# Altium schematic sheet Модуль MCU.SchDoc
size 420 x 297 mm; DocumentNumber: 8; SheetNumber: 8; SheetTotal: 11; ListNumber: 1
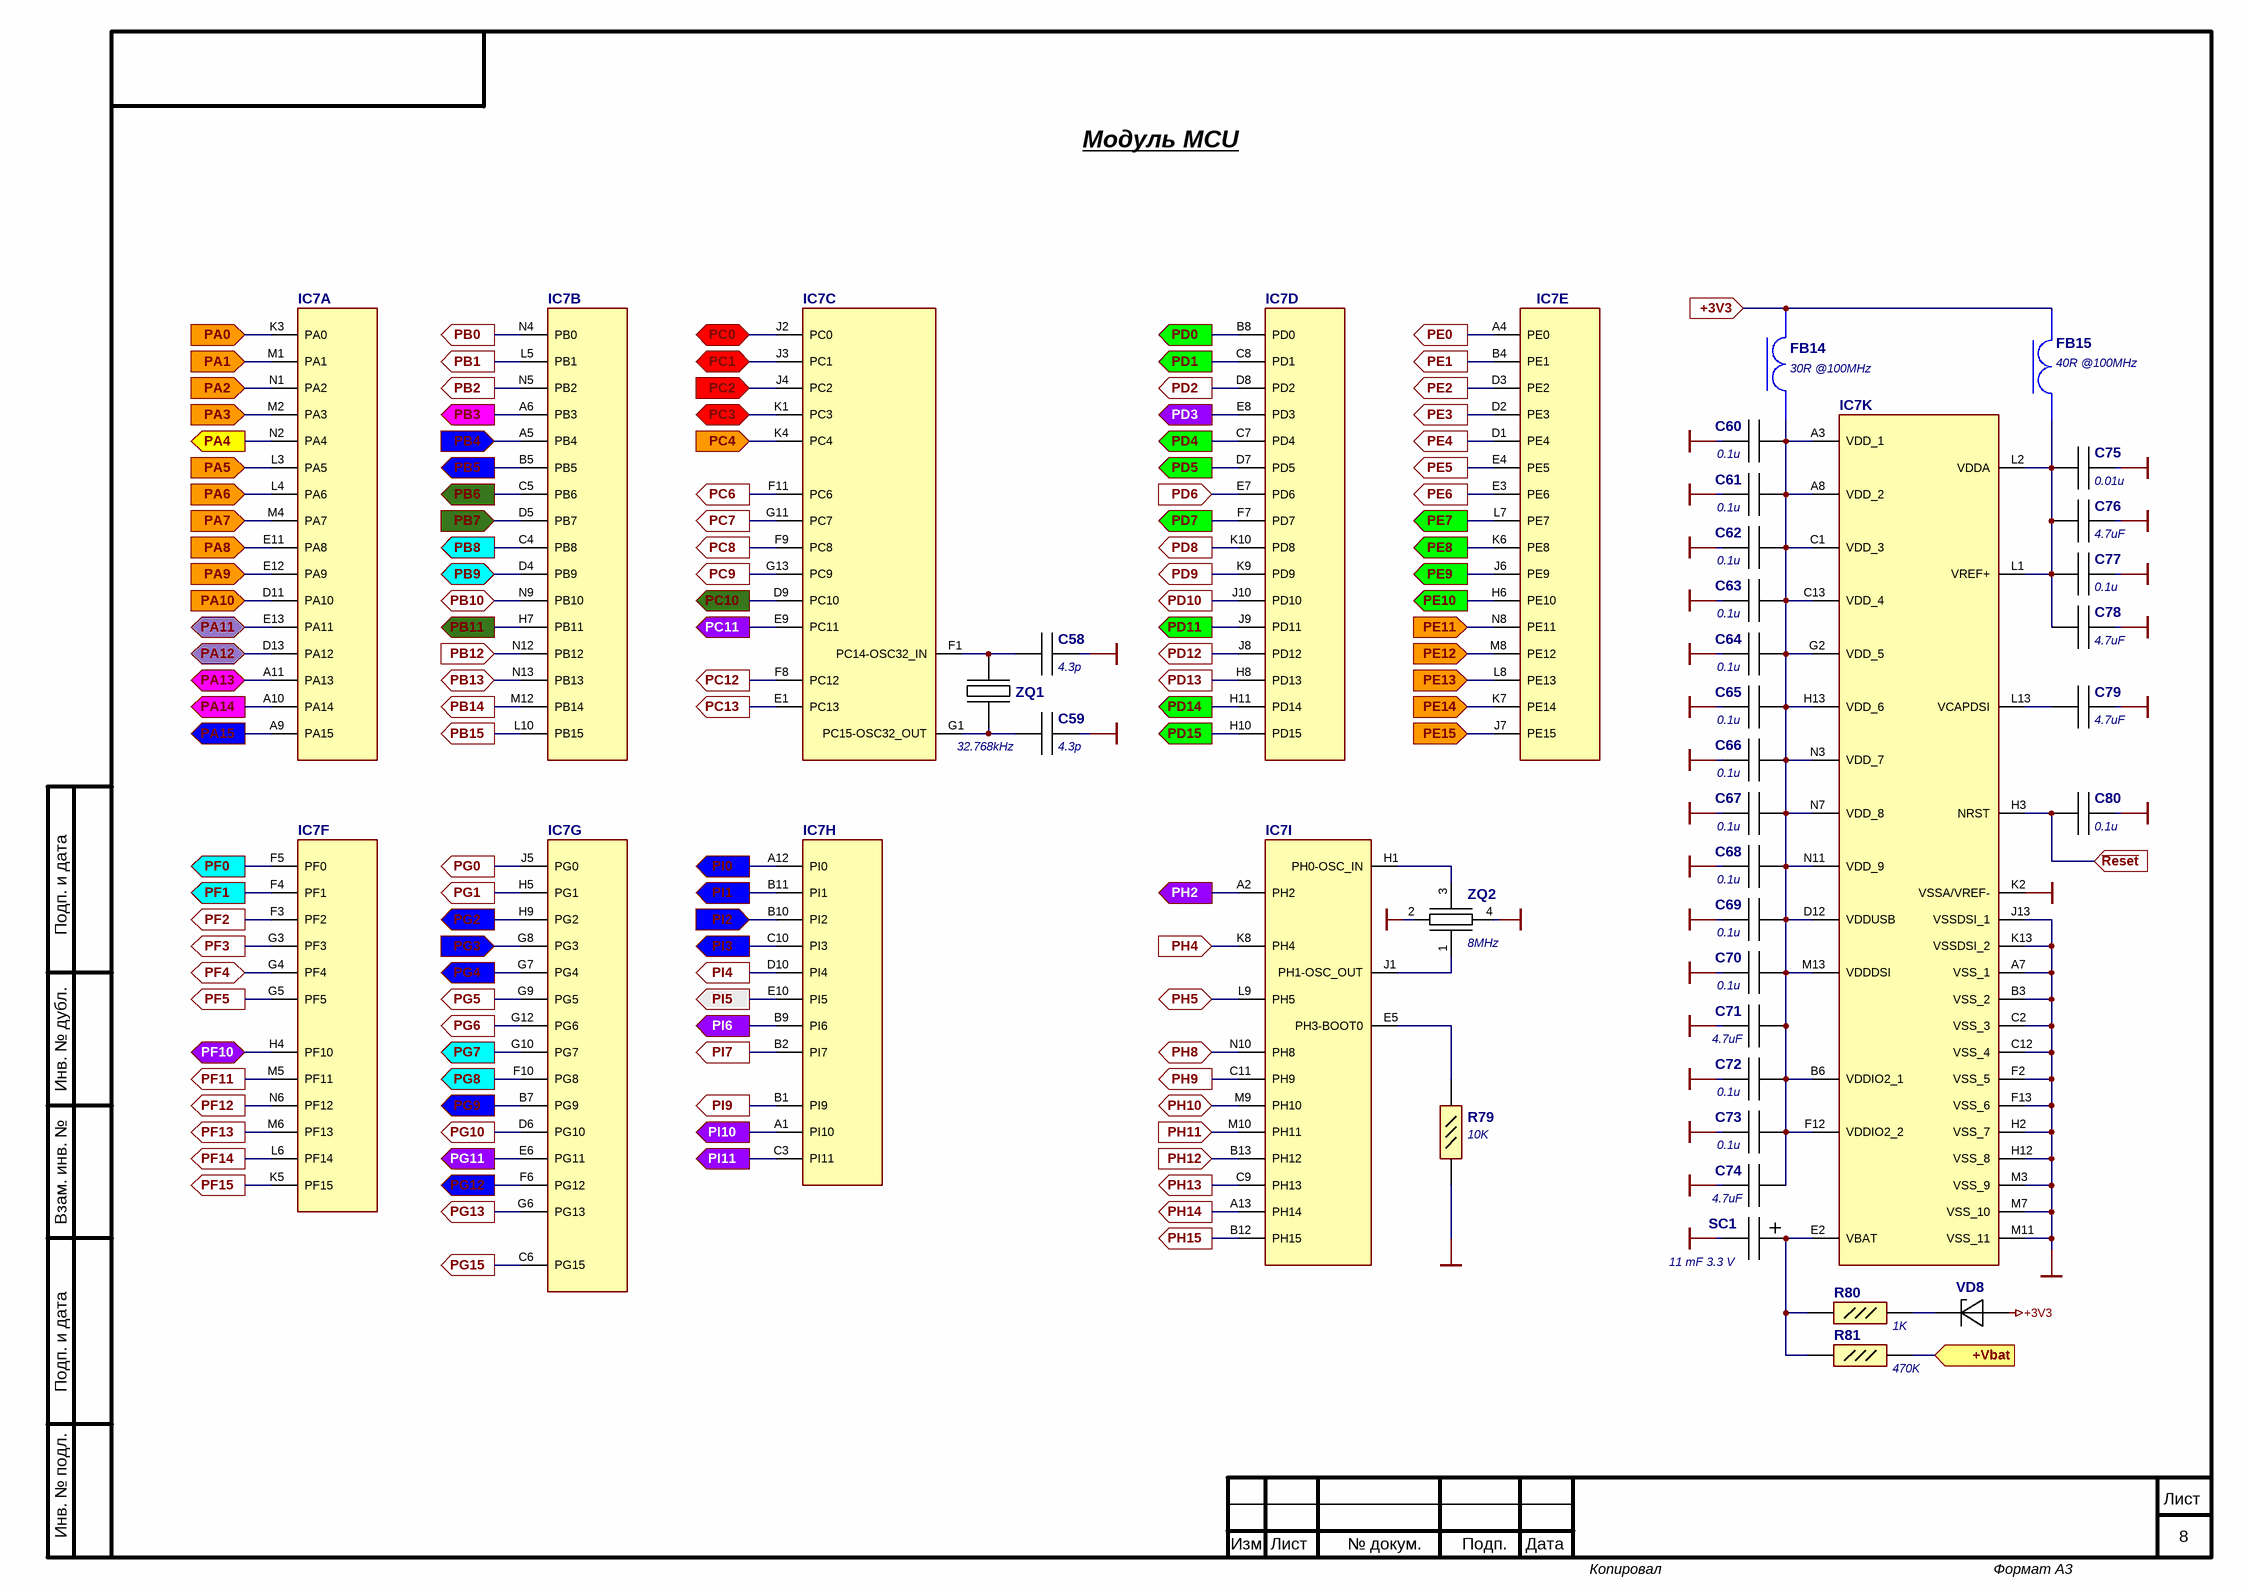
[diagram p0: Модуль MCU.SchDoc]

## Parts
C58  4.3p  [:CAP0402 100x50x50]
C59  4.3p  [:CAP0402 100x50x50]
C60  0.1u  [:CAP0402 100x50x50]
C61  0.1u  [:CAP0402 100x50x50]
C62  0.1u  [:CAP0402 100x50x50]
C63  0.1u  [:CAP0402 100x50x50]
C64  0.1u  [:CAP0402 100x50x50]
C65  0.1u  [:CAP0402 100x50x50]
C66  0.1u  [:CAP0402 100x50x50]
C67  0.1u  [:CAP0402 100x50x50]
C68  0.1u  [:CAP0402 100x50x50]
C69  0.1u  [:CAP0402 100x50x50]
C70  0.1u  [:CAP0402 100x50x50]
C71  4.7uF  [:CAP0805 C2012X125]
C72  0.1u  [:CAP0402 100x50x50]
C73  0.1u  [:CAP0402 100x50x50]
C74  4.7uF  [:CAP0805 C2012X125]
C75  0.01u  [:CAP0402 100x50x50]
C76  4.7uF  [:CAP0805 C2012X125]
C77  0.1u  [:CAP0402 100x50x50]
C78  4.7uF  [:CAP0805 C2012X125]
C79  4.7uF  [:CAP0805 C2012X125]
C80  0.1u  [:CAP0402 100x50x50]
FB14  30R @100MHz  [:FER BLM18SP300SN1D]
FB15  40R @100MHz  [:FER MMZ1005Y400CTD25]
IC7  STM32L4S9AII6  [:BGA169 P700X700X60]  (value not drawn)  (parts A,B,C,D,E,F,G,H,I,K of 11)
R79  Manufacturer_Part_Number (part 2: value): 10K  [:RES0402]  (hidden comment: RC0402FR-07)
R80  Manufacturer_Part_Number (part 2: value): 1K  [:RES0402]  (hidden comment: RC0402FR-07)
R81  Manufacturer_Part_Number (part 2: value): 470K  [:RES0402]  (hidden comment: RC0402FR-07)
SC1  11 mF 3.3 V  [:CAP CPH3225A]
VD8  30V 0.1A  [:DIODE SOD-923F]  (value not drawn)
ZQ1  32.768kHz  [:RESO 12.87181]
ZQ2  8MHz  [:RESO LFXTAL069277REEL]

## Ports
+3V3 (in), +Vbat (in), PA0 (in), PA1 (in), PA2 (in), PA3 (in), PA4 (out), PA5 (in), PA6 (in), PA7 (in), PA8 (in), PA9 (in), PA10 (in), PA11 (bidir), PA12 (bidir), PA13 (bidir), PA14 (out), PA15 (out), PB0 (out), PB1 (out), PB2 (out), PB3 (out), PB4 (in), PB5 (out), PB6 (out), PB7 (in), PB8 (out), PB9 (bidir), PB10 (bidir), PB11 (out), PB12 (in), PB13 (bidir), PB14 (out), PB15 (out), PC0 (bidir), PC1 (bidir), PC2 (in), PC3 (bidir), PC4 (in), PC6 (out), PC7 (out), PC8 (out), PC9 (out), PC10 (out), PC11 (out), PC12 (out), PC13 (out), PD0 (out), PD1 (out), PD2 (out), PD3 (out), PD4 (out), PD5 (out), PD6 (in), PD7 (out), PD8 (out), PD9 (out), PD10 (out), PD11 (out), PD12 (out), PD13 (out), PD14 (out), PD15 (out), PE0 (out), PE1 (out), PE2 (out), PE3 (out), PE4 (out), PE5 (out), PE6 (out), PE7 (out), PE8 (out), PE9 (out), PE10 (out), PE11 (in), PE12 (in), PE13 (in), PE14 (in), PE15 (in), PF0 (out), PF1 (out), PF2 (out), PF3 (out), PF4 (bidir), PF5 (out), PF10 (bidir), PF11 (out), PF12 (out), PF13 (out), PF14 (out), PF15 (out), PG0 (out), PG1 (out), PG2 (out), PG3 (in), PG4 (out), PG5 (out), PG6 (out), PG7 (out), PG8 (out), PG9 (out), PG10 (out), PG11 (out), PG12 (out), PG13 (out), PG15 (out), PH2 (out), PH4 (in), PH5 (bidir), PH8 (bidir), PH9 (out), PH10 (bidir), PH11 (in), PH12 (in), PH13 (out), PH14 (out), PH15 (out), PI0 (out), PI1 (out), PI2 (in), PI3 (out), PI4 (out), PI5 (out), PI6 (out), PI7 (out), PI9 (out), PI10 (out), PI11 (out), ~{Reset} (in)

## Nets
+3V3: VD8.2(A)
GND: C58.2 C59.2 C60.1 C61.1 C62.1 C63.1 C64.1 C65.1 C66.1 C67.1 C68.1 C69.1 C70.1 C71.2 C72.1 C73.1 C74.2 C75.2 C76.2 C77.2 C78.2 C79.2 C80.2 IC7.A7(VSS_1) IC7.B3(VSS_2) IC7.C2(VSS_3) IC7.C12(VSS_4) IC7.F2(VSS_5) IC7.F13(VSS_6) IC7.H2(VSS_7) IC7.H12(VSS_8) IC7.J13(VSSDSI_1) IC7.K2(VSSA/VREF-) IC7.K13(VSSDSI_2) IC7.M3(VSS_9) IC7.M7(VSS_10) IC7.M11(VSS_11) R79.1 SC1.2(-) ZQ2.2 ZQ2.4
+3V3: FB14.2 FB15.1 ; port +3V3  [a separate net that carries the same name]
+Vbat: R81.1 ; port +Vbat
PA0: IC7.K3(PA0) ; port PA0
PA1: IC7.M1(PA1) ; port PA1
PA2: IC7.N1(PA2) ; port PA2
PA3: IC7.M2(PA3) ; port PA3
PA4: IC7.N2(PA4) ; port PA4
PA5: IC7.L3(PA5) ; port PA5
PA6: IC7.L4(PA6) ; port PA6
PA7: IC7.M4(PA7) ; port PA7
PA8: IC7.E11(PA8) ; port PA8
PA9: IC7.E12(PA9) ; port PA9
PA10: IC7.D11(PA10) ; port PA10
PA11: IC7.E13(PA11) ; port PA11
PA12: IC7.D13(PA12) ; port PA12
PA13: IC7.A11(PA13) ; port PA13
PA14: IC7.A10(PA14) ; port PA14
PA15: IC7.A9(PA15) ; port PA15
PB0: IC7.N4(PB0) ; port PB0
PB1: IC7.L5(PB1) ; port PB1
PB2: IC7.N5(PB2) ; port PB2
PB3: IC7.A6(PB3) ; port PB3
PB4: IC7.A5(PB4) ; port PB4
PB5: IC7.B5(PB5) ; port PB5
PB6: IC7.C5(PB6) ; port PB6
PB7: IC7.D5(PB7) ; port PB7
PB8: IC7.C4(PB8) ; port PB8
PB9: IC7.D4(PB9) ; port PB9
PB10: IC7.N9(PB10) ; port PB10
PB11: IC7.H7(PB11) ; port PB11
PB12: IC7.N12(PB12) ; port PB12
PB13: IC7.N13(PB13) ; port PB13
PB14: IC7.M12(PB14) ; port PB14
PB15: IC7.L10(PB15) ; port PB15
PC0: IC7.J2(PC0) ; port PC0
PC1: IC7.J3(PC1) ; port PC1
PC2: IC7.J4(PC2) ; port PC2
PC3: IC7.K1(PC3) ; port PC3
PC4: IC7.K4(PC4) ; port PC4
PC6: IC7.F11(PC6) ; port PC6
PC7: IC7.G11(PC7) ; port PC7
PC8: IC7.F9(PC8) ; port PC8
PC9: IC7.G13(PC9) ; port PC9
PC10: IC7.D9(PC10) ; port PC10
PC11: IC7.E9(PC11) ; port PC11
PC12: IC7.F8(PC12) ; port PC12
PC13: IC7.E1(PC13) ; port PC13
PD0: IC7.B8(PD0) ; port PD0
PD1: IC7.C8(PD1) ; port PD1
PD2: IC7.D8(PD2) ; port PD2
PD3: IC7.E8(PD3) ; port PD3
PD4: IC7.C7(PD4) ; port PD4
PD5: IC7.D7(PD5) ; port PD5
PD6: IC7.E7(PD6) ; port PD6
PD7: IC7.F7(PD7) ; port PD7
PD8: IC7.K10(PD8) ; port PD8
PD9: IC7.K9(PD9) ; port PD9
PD10: IC7.J10(PD10) ; port PD10
PD11: IC7.J9(PD11) ; port PD11
PD12: IC7.J8(PD12) ; port PD12
PD13: IC7.H8(PD13) ; port PD13
PD14: IC7.H11(PD14) ; port PD14
PD15: IC7.H10(PD15) ; port PD15
PE0: IC7.A4(PE0) ; port PE0
PE1: IC7.B4(PE1) ; port PE1
PE2: IC7.D3(PE2) ; port PE2
PE3: IC7.D2(PE3) ; port PE3
PE4: IC7.D1(PE4) ; port PE4
PE5: IC7.E4(PE5) ; port PE5
PE6: IC7.E3(PE6) ; port PE6
PE7: IC7.L7(PE7) ; port PE7
PE8: IC7.K6(PE8) ; port PE8
PE9: IC7.J6(PE9) ; port PE9
PE10: IC7.H6(PE10) ; port PE10
PE11: IC7.N8(PE11) ; port PE11
PE12: IC7.M8(PE12) ; port PE12
PE13: IC7.L8(PE13) ; port PE13
PE14: IC7.K7(PE14) ; port PE14
PE15: IC7.J7(PE15) ; port PE15
PF0: IC7.F5(PF0) ; port PF0
PF1: IC7.F4(PF1) ; port PF1
PF2: IC7.F3(PF2) ; port PF2
PF3: IC7.G3(PF3) ; port PF3
PF4: IC7.G4(PF4) ; port PF4
PF5: IC7.G5(PF5) ; port PF5
PF10: IC7.H4(PF10) ; port PF10
PF11: IC7.M5(PF11) ; port PF11
PF12: IC7.N6(PF12) ; port PF12
PF13: IC7.M6(PF13) ; port PF13
PF14: IC7.L6(PF14) ; port PF14
PF15: IC7.K5(PF15) ; port PF15
PG0: IC7.J5(PG0) ; port PG0
PG1: IC7.H5(PG1) ; port PG1
PG2: IC7.H9(PG2) ; port PG2
PG3: IC7.G8(PG3) ; port PG3
PG4: IC7.G7(PG4) ; port PG4
PG5: IC7.G9(PG5) ; port PG5
PG6: IC7.G12(PG6) ; port PG6
PG7: IC7.G10(PG7) ; port PG7
PG8: IC7.F10(PG8) ; port PG8
PG9: IC7.B7(PG9) ; port PG9
PG10: IC7.D6(PG10) ; port PG10
PG11: IC7.E6(PG11) ; port PG11
PG12: IC7.F6(PG12) ; port PG12
PG13: IC7.G6(PG13) ; port PG13
PG15: IC7.C6(PG15) ; port PG15
PH2: IC7.A2(PH2) ; port PH2
PH4: IC7.K8(PH4) ; port PH4
PH5: IC7.L9(PH5) ; port PH5
PH8: IC7.N10(PH8) ; port PH8
PH9: IC7.C11(PH9) ; port PH9
PH10: IC7.M9(PH10) ; port PH10
PH11: IC7.M10(PH11) ; port PH11
PH12: IC7.B13(PH12) ; port PH12
PH13: IC7.C9(PH13) ; port PH13
PH14: IC7.A13(PH14) ; port PH14
PH15: IC7.B12(PH15) ; port PH15
PI0: IC7.A12(PI0) ; port PI0
PI1: IC7.B11(PI1) ; port PI1
PI2: IC7.B10(PI2) ; port PI2
PI3: IC7.C10(PI3) ; port PI3
PI4: IC7.D10(PI4) ; port PI4
PI5: IC7.E10(PI5) ; port PI5
PI6: IC7.B9(PI6) ; port PI6
PI7: IC7.B2(PI7) ; port PI7
PI9: IC7.B1(PI9) ; port PI9
PI10: IC7.A1(PI10) ; port PI10
PI11: IC7.C3(PI11) ; port PI11
~{Reset}: C80.1 IC7.H3(NRST) ; port ~{Reset}
NetC58_1: C58.1 IC7.F1(PC14-OSC32_IN) ZQ1.2
NetC59_1: C59.1 IC7.G1(PC15-OSC32_OUT) ZQ1.1
NetC60_2: C60.2 C61.2 C62.2 C63.2 C64.2 C65.2 C66.2 C67.2 C68.2 C69.2 C70.2 C71.1 C72.2 C73.2 C74.1 FB14.1 IC7.A3(VDD_1) IC7.A8(VDD_2) IC7.B6(VDDIO2_1) IC7.C1(VDD_3) IC7.C13(VDD_4) IC7.D12(VDDUSB) IC7.F12(VDDIO2_2) IC7.G2(VDD_5) IC7.H13(VDD_6) IC7.M13(VDDDSI) IC7.N3(VDD_7) IC7.N7(VDD_8) IC7.N11(VDD_9)
NetC75_1: C75.1 C76.1 C77.1 C78.1 FB15.2 IC7.L1(VREF+) IC7.L2(VDDA)
NetC79_1: C79.1 IC7.L13(VCAPDSI)
NetIC7_E2: IC7.E2(VBAT) R80.2 R81.2 SC1.1(+)
NetIC7_E5: IC7.E5(PH3-BOOT0) R79.2
NetIC7_H1: IC7.H1(PH0-OSC_IN) ZQ2.3
NetIC7_J1: IC7.J1(PH1-OSC_OUT) ZQ2.1
NetR80_1: R80.1 VD8.1(K)

## Notes on the sheet
- Модуль MCU
- Подп. и дата
- Инв. № дубл.
- Взам. инв. №
- Инв. № подл.
- Лист
- Изм.
- № докум.
- Подп.
- Дата
- Копировал
- Формат А3

## Library data of the parts
C58 C59 = GJM1555C1H4R3CB01D: CAP CER  50V C0G/NP0 0402; Manufacturer_Name: Murata Electronics; Short Description: 0402 4.3p 50V; Manufacturer_Part_Number: GJM1555C1H4R3CB01D
C60-C70 C72 C73 C77 C80 = GRM155R71E104KE14J: ±10% 25V Ceramic Capacitor X7R 0402 (1005 Metric); Manufacturer_Name: Murata Electronics; Short Description: 0402 0.1uF 25V; Datasheet Link: http://www.murata.com/~/media/webrenewal/support/library/catalog/products/capacitor/mlcc/c02e.pdf; Height: 0.55mm; Manufacturer_Part_Number: GRM155R71E104KE14J; Mouser Part Number: 81-GRM155R71E104KE4J; Mouser Price/Stock: https://www.mouser.co.uk/ProductDetail/Murata-Electronics/GRM155R71E104KE14J?qs=hNud%2FORuBR2EQtvG2InwAQ%3D%3D; Arrow Part Number: GRM155R71E104KE14J; Arrow Price/Stock: https://www.arrow.com/en/products/grm155r71e104ke14j/murata-manufacturing
C71 C74 C76 C78 C79 = GRM21BZ71E475KE15L: CAP CER 4.7uF 25V X7R 0805; Manufacturer_Name: Murata Electronics; Short Description: 0805 4.7uF 25V; Datasheet Link: https://search.murata.co.jp/Ceramy/image/img/A01X/G101/ENG/GRM21BZ71E475KE15-01.pdf; Height: 1.45mm; Manufacturer_Part_Number: GRM21BZ71E475KE15L
C75 = GRM1555CYA103JE01D: ±5% 35V Ceramic Capacitor C0G, NP0 0402 (1005 Metric); Manufacturer_Name: Murata Electronics; Short Description: 0402 0.01u 35V; Datasheet Link: https://search.murata.co.jp/Ceramy/image/img/A01X/G101/ENG/GRM1555CYA103JE01-01A.pdf; Height: 0.55mm; Manufacturer_Part_Number: GRM1555CYA103JE01D
FB14 = BLM18SP300SN1D: 30 Ohms @ 100MHz 1 Power Line Ferrite Bead 0603 (1608 Metric) 6A 8mOhm; Manufacturer_Name: Murata Electronics; Short Description: 0603 30R @100MHz; Datasheet Link: http://www.murata.com/~/media/webrenewal/support/library/catalog/products/emc/emifil/c31e.ashx?la=en-gb; Height: 0.95mm; Manufacturer_Part_Number: BLM18SP300SN1D; Mouser Part Number: 81-BLM18SP300SN1D; Mouser Price/Stock: https://www.mouser.co.uk/ProductDetail/Murata-Electronics/BLM18SP300SN1D/?qs=W%2FMpXkg%252BdQ4o%252BOP%252B6m8FYA%3D%3D
FB15 = MMZ1005Y400CTD25: 40 Ohms @ 100MHz 1 Signal Line Ferrite Bead 0402 (1005 Metric) 550mA 100mOhm; Manufacturer_Name: TDK; Short Description: 0402 40R @100MHz; Datasheet Link: https://www.arrow.com/en/products/mmz1005y400ctd25/tdk; Height: 0.55mm; Manufacturer_Part_Number: MMZ1005Y400CTD25; Mouser Part Number: 810-MMZ1005Y400CTD25; Mouser Price/Stock: https://www.mouser.com/Search/Refine.aspx?Keyword=810-MMZ1005Y400CTD25; Arrow Part Number: MMZ1005Y400CTD25; Arrow Price/Stock: https://www.arrow.com/en/products/mmz1005y400ctd25/tdk
IC7 = STM32L4S9AII6: MCU 32BIT 2MB FLASH; Manufacturer_Name: STMicroelectronics; Datasheet Link: https://www.arrow.com/en/products/stm32l4s9aii6/stmicroelectronics; Height: 0.6mm; Manufacturer_Part_Number: STM32L4S9AII6; Mouser Part Number: 511-STM32L4S9AII6; Mouser Price/Stock: https://www.mouser.co.uk/ProductDetail/STMicroelectronics/STM32L4S9AII6?qs=wd5RIQLrsJhTDo%252BO4Z5Vcw%3D%3D; Arrow Part Number: STM32L4S9AII6; Arrow Price/Stock: https://www.arrow.com/en/products/stm32l4s9aii6/stmicroelectronics
R79-R81 = RC0402FR-07: Resistor 0402 1% 1/16W / Value Range: 1Ω ... 10 MΩ / Value Example: / 0R = 0Ω / 97R6 = 97.6Ω / 9K76 = 9760Ω / 1M = 1,000,000Ω; Manufacturer_Name: YAGEO; Manufacturer_Part_Number (part 3: after value): L; Short Description: 0402 1%; Datasheet Link: http://www.yageo.com/documents/recent/PYu-RC0402_51_RoHS_L_6_r.pdf; Height: 0.4mm; Manufacturer_Part_Number: RC0402FR-07; Parameter 1: *
SC1 = CPH3225A: 11 mF (EDLC) Supercapacitor 3.3 V 1210 (3225 Metric); Manufacturer_Name: Seiko Instruments Micro Energy; Short Description: 1210 11mF 3.3V; Datasheet Link: https://www.sii.co.jp/en/me/datasheets/chip-capacitor/cph3225a/; Height: 1mm; Manufacturer_Part_Number: CPH3225A; Mouser Part Number: 628-CPH3225A; Mouser Price/Stock: https://www.mouser.com/Search/Refine.aspx?Keyword=628-CPH3225A
VD8 = CDBQR0130R: Diodes Schottky 0402 30V 0.1A; Manufacturer_Name: Comchip Technology; Datasheet Link: http://www.comchiptech.com/admin/files/product/CDBQR0130R-HF-RevC796140.pdf; Height: 0.55mm; Manufacturer_Part_Number: CDBQR0130R; Mouser Part Number: 750-CDBQR0130R; Mouser Price/Stock: https://www.mouser.co.uk/ProductDetail/Comchip-Technology/CDBQR0130R?qs=tw%252BuQ%2FB6PO3SSBtQ52w%2FCg%3D%3D; Arrow Part Number: CDBQR0130R; Arrow Price/Stock: https://www.arrow.com/en/products/cdbqr0130r/comchip-technology; Short Description: 0402 30V 0.1A
ZQ1 = 12.87181: CRYSTAL 32.7680KHZ / ±20ppm Crystal 12.5pF 2-SMD / ESR: 70 kOhms; Manufacturer_Name: Geyer Electronic America, Inc.; Manufacturer_Part_Number: 12.87181; Short Description: 32.768kHz
ZQ2 = LFXTAL069277REEL: CRYSTAL 8MHz / ±20ppm Crystal 20pF 4-SMD / ESR: 150 Ohms; Manufacturer_Name: IQD Frequency Products; Manufacturer_Part_Number: LFXTAL069277REEL; Short Description: 8MHz